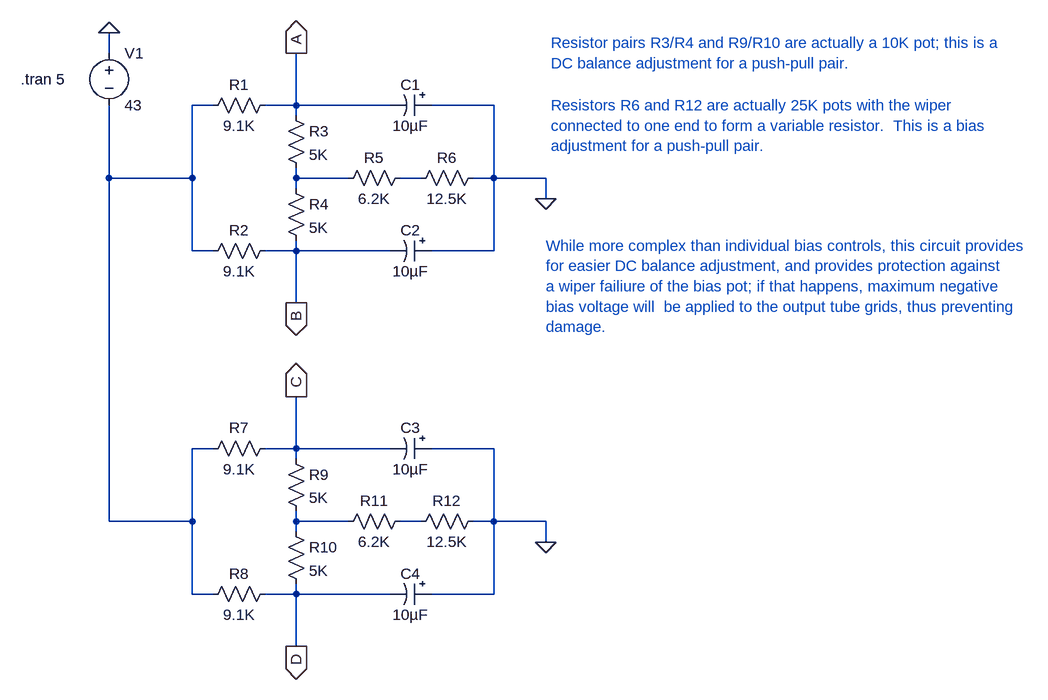
[diagram p0: schematic Bias_Balance_Network.asc]
Bias_Balance_Network.asc, the LTspice schematic file:
Version 4
SHEET 1 1360 912
WIRE -112 -64 -112 -96
WIRE 48 16 16 16
WIRE 176 16 176 -64
WIRE 176 16 128 16
WIRE 320 16 176 16
WIRE 480 16 384 16
WIRE 176 32 176 16
WIRE -112 128 -112 16
WIRE 16 128 16 16
WIRE 16 128 -112 128
WIRE 176 128 176 112
WIRE 256 128 176 128
WIRE 368 128 336 128
WIRE 480 128 480 16
WIRE 480 128 448 128
WIRE 560 128 480 128
WIRE 176 144 176 128
WIRE 560 160 560 128
WIRE 16 240 16 128
WIRE 48 240 16 240
WIRE 176 240 176 224
WIRE 176 240 128 240
WIRE 320 240 176 240
WIRE 480 240 480 128
WIRE 480 240 384 240
WIRE 176 320 176 240
WIRE 48 544 16 544
WIRE 176 544 176 464
WIRE 176 544 128 544
WIRE 320 544 176 544
WIRE 480 544 384 544
WIRE 176 560 176 544
WIRE -112 656 -112 128
WIRE 16 656 16 544
WIRE 16 656 -112 656
WIRE 176 656 176 640
WIRE 256 656 176 656
WIRE 368 656 336 656
WIRE 480 656 480 544
WIRE 480 656 448 656
WIRE 560 656 480 656
WIRE 176 672 176 656
WIRE 560 688 560 656
WIRE 16 768 16 656
WIRE 48 768 16 768
WIRE 176 768 176 752
WIRE 176 768 128 768
WIRE 320 768 176 768
WIRE 480 768 480 656
WIRE 480 768 384 768
WIRE 176 848 176 768
FLAG -112 -96 0
FLAG 560 160 0
FLAG 176 -64 A
IOPIN 176 -64 Out
FLAG 176 320 B
IOPIN 176 320 Out
FLAG 560 688 0
FLAG 176 464 C
IOPIN 176 464 Out
FLAG 176 848 D
IOPIN 176 848 Out
SYMBOL res 160 16 R0
SYMATTR InstName R3
SYMATTR Value 5K
SYMBOL res 160 128 R0
SYMATTR InstName R4
SYMATTR Value 5K
SYMBOL res 352 112 R90
WINDOW 0 0 56 VBottom 2
WINDOW 3 32 56 VTop 2
SYMATTR InstName R5
SYMATTR Value 6.2K
SYMBOL res 464 112 R90
WINDOW 0 0 56 VBottom 2
WINDOW 3 32 56 VTop 2
SYMATTR InstName R6
SYMATTR Value 12.5K
SYMBOL res 144 0 R90
WINDOW 0 0 56 VBottom 2
WINDOW 3 32 56 VTop 2
SYMATTR InstName R1
SYMATTR Value 9.1K
SYMBOL res 144 224 R90
WINDOW 0 0 56 VBottom 2
WINDOW 3 32 56 VTop 2
SYMATTR InstName R2
SYMATTR Value 9.1K
SYMBOL polcap 384 0 R90
WINDOW 0 0 32 VBottom 2
WINDOW 3 32 32 VTop 2
SYMATTR InstName C1
SYMATTR Value 10µF
SYMBOL polcap 384 224 R90
WINDOW 0 0 32 VBottom 2
WINDOW 3 32 32 VTop 2
SYMATTR InstName C2
SYMATTR Value 10µF
SYMBOL voltage -112 -80 R0
SYMATTR InstName V1
SYMATTR Value 43
SYMBOL res 160 544 R0
SYMATTR InstName R9
SYMATTR Value 5K
SYMBOL res 160 656 R0
SYMATTR InstName R10
SYMATTR Value 5K
SYMBOL res 352 640 R90
WINDOW 0 0 56 VBottom 2
WINDOW 3 32 56 VTop 2
SYMATTR InstName R11
SYMATTR Value 6.2K
SYMBOL res 464 640 R90
WINDOW 0 0 56 VBottom 2
WINDOW 3 32 56 VTop 2
SYMATTR InstName R12
SYMATTR Value 12.5K
SYMBOL res 144 528 R90
WINDOW 0 0 56 VBottom 2
WINDOW 3 32 56 VTop 2
SYMATTR InstName R7
SYMATTR Value 9.1K
SYMBOL res 144 752 R90
WINDOW 0 0 56 VBottom 2
WINDOW 3 32 56 VTop 2
SYMATTR InstName R8
SYMATTR Value 9.1K
SYMBOL polcap 384 528 R90
WINDOW 0 0 32 VBottom 2
WINDOW 3 32 32 VTop 2
SYMATTR InstName C3
SYMATTR Value 10µF
SYMBOL polcap 384 752 R90
WINDOW 0 0 32 VBottom 2
WINDOW 3 32 32 VTop 2
SYMATTR InstName C4
SYMATTR Value 10µF
TEXT -248 -24 Left 2 !.tran 5
TEXT 568 -80 Left 2 ;Resistor pairs R3/R4 and R9/R10 are actually a 10K pot; this is a\nDC balance adjustment for a push-pull pair.
TEXT 560 232 Left 2 ;While more complex than individual bias controls, this circuit provides\nfor easier DC balance adjustment, and provides protection against\na wiper failiure of the bias pot; if that happens, maximum negative\nbias voltage will  be applied to the output tube grids, thus preventing\ndamage.
TEXT 568 16 Left 2 ;Resistors R6 and R12 are actually 25K pots with the wiper\nconnected to one end to form a variable resistor.  This is a bias\nadjustment for a push-pull pair.

The netlist it stands for:
* Bias_Balance_Network.asc
R3 A N002 5K
R4 N002 B 5K
R5 N003 N002 6.2K
R6 0 N003 12.5K
R1 A N001 9.1K
R2 B N001 9.1K
C1 0 A 10µF
C2 0 B 10µF
V1 0 N001 43
R9 C N004 5K
R10 N004 D 5K
R11 N005 N004 6.2K
R12 0 N005 12.5K
R7 C N001 9.1K
R8 D N001 9.1K
C3 0 C 10µF
C4 0 D 10µF
.tran 5
* Resistor pairs R3/R4 and R9/R10 are actually a 10K pot; this is a
* DC balance adjustment for a push-pull pair.
* While more complex than individual bias controls, this circuit provides
* for easier DC balance adjustment, and provides protection against
* a wiper failiure of the bias pot; if that happens, maximum negative
* bias voltage will  be applied to the output tube grids, thus preventing
* damage.
* Resistors R6 and R12 are actually 25K pots with the wiper
* connected to one end to form a variable resistor.  This is a bias
* adjustment for a push-pull pair.
.backanno
.end